# EAGLE design NXPESC-UF1_test004 (EAGLE 7.6.0)

## Sheet 1 of 4
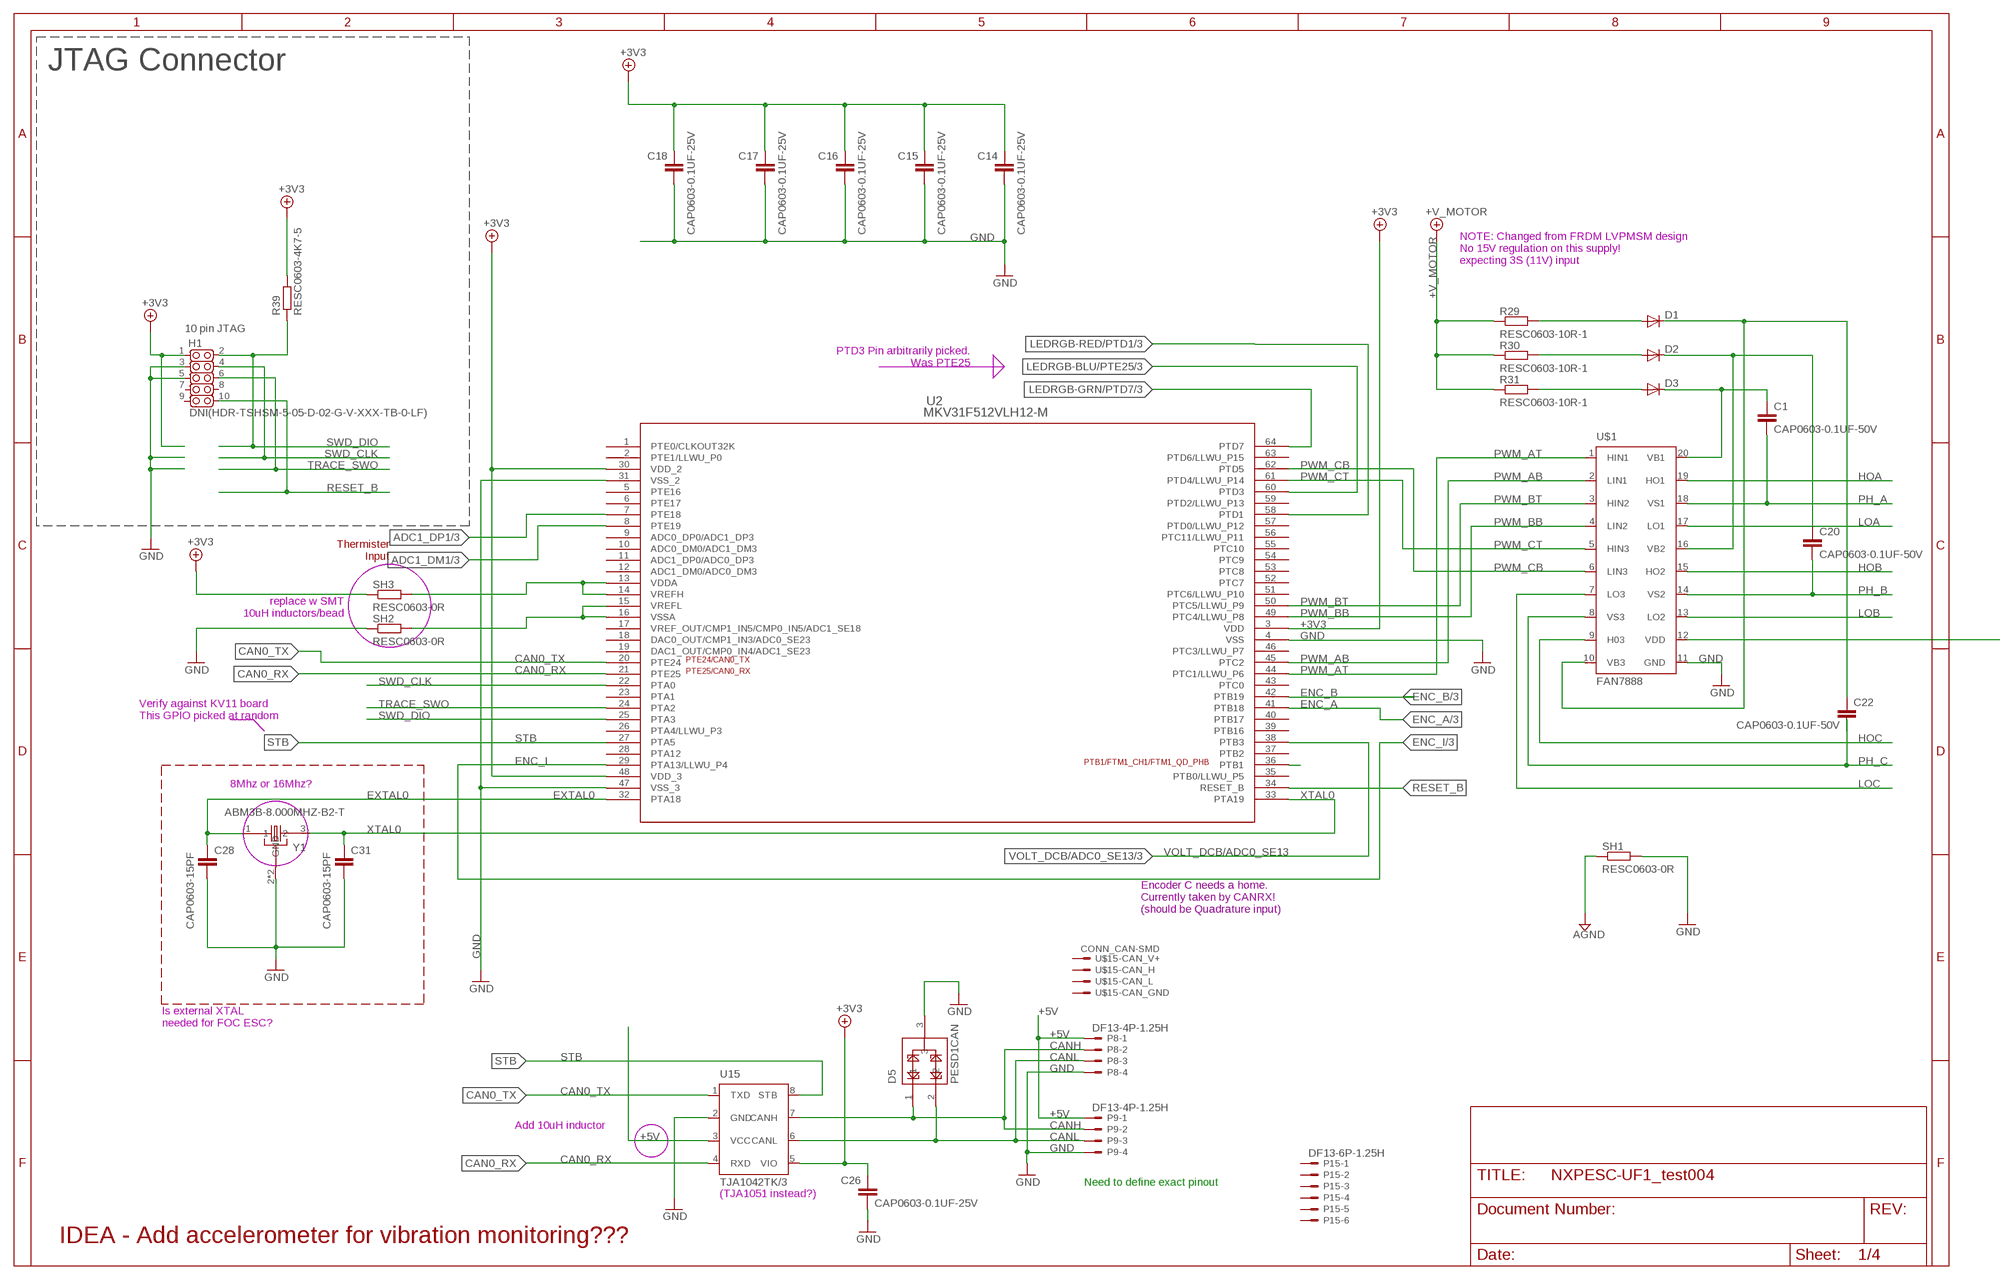
[diagram p0: schematic, sheet 1, part 1 of 2]
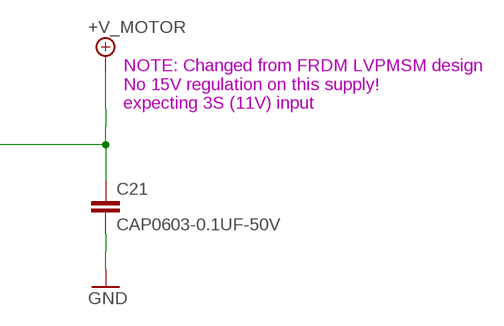
[diagram p1: schematic, sheet 1, part 2 of 2]

### Parts
C1  CAP0603-0.1UF-50V  [C0603]
C14  CAP0603-0.1UF-25V  [C0603]
C15  CAP0603-0.1UF-25V  [C0603]
C16  CAP0603-0.1UF-25V  [C0603]
C17  CAP0603-0.1UF-25V  [C0603]
C18  CAP0603-0.1UF-25V  [C0603]
C20  CAP0603-0.1UF-50V  [C0603]
C21  CAP0603-0.1UF-50V  [C0603]
C22  CAP0603-0.1UF-50V  [C0603]
C26  CAP0603-0.1UF-25V  [C0603]
C28  CAP0603-15PF  [C0603]
C31  CAP0603-15PF  [C0603]
D1  DIODE-SOD323-R  [SOD323-R]
D2  DIODE-SOD323-R  [SOD323-R]
D3  DIODE-SOD323-R  [SOD323-R]
D5  PESD1CAN  [SOT23-3]
H1  DNI(HDR-TSHSM-5-05-D-02-G-V-XXX-TB-0-LF)  HDR-TSHSM-5-05-D-02-G-V-XXX-TB-0-LF  [HD2X5-SMD-0.05"]
P8  DF13-4P-1.25H  [DF13A-4P-1.25H]
P9  DF13-4P-1.25H  [DF13A-4P-1.25H]
P15  DF13-6P-1.25H  [DF13A-6P-1.25H]
R29  RESC0603-10R-1  [C0603]
R30  RESC0603-10R-1  [C0603]
R31  RESC0603-10R-1  [C0603]
R39  RESC0603-4K7-5  [C0603]
SH1  RESC0603-0R  [C0603]
SH2  RESC0603-0R  [C0603]
SH3  RESC0603-0R  [C0603]
U2  MKV31F512VLH12-M  [LQFP-64_10X10X1_6-M]
U15  TJA1042TK/3  [HVSON8]
U$1  FAN7888  [SOIC-20]
U$15  CONN_CAN-SMD  [S4B-PH-SM4-TB]
Y1  ABM3B-8.000MHZ-B2-T  [OSCSC500X320X110-4N]

### Nets
+3V3: C14.1 C15.1 C16.1 C17.1 C18.1 C26.1 H1.1 R39.2 SH3.1 U2.3(VDD) U2.30(VDD_2) U2.48(VDD_3) U15.5(VIO) ; also sheet 2,3
+5V: P8.1 P9.1 U15.3(VCC) ; also sheet 3
+V_MOTOR: C21.1 R29.1 R30.1 R31.1 U$1.12(VDD) ; also sheet 2,3
ADC1_DM1: U2.8(PTE19) ; also sheet 3
ADC1_DP1: U2.7(PTE18) ; also sheet 3
AGND: SH1.1 ; also sheet 2,3
CAN0_RX: U2.21(PTE25) U15.4(RXD)
CAN0_TX: U2.20(PTE24) U15.1(TXD)
CANH: D5.1 P8.2 P9.2 U15.7(CANH)
CANL: D5.2 P8.3 P9.3 U15.6(CANL)
ENC_A: U2.41(PTB18) ; also sheet 3
ENC_B: U2.42(PTB19) ; also sheet 3
ENC_I: U2.29(PTA13/LLWU_P4) ; also sheet 3
EXTAL0: C28.1 U2.32(PTA18) Y1.1
GND: C14.2 C15.2 C16.2 C17.2 C18.2 C21.2 C26.2 C28.2 C31.2 D5.3 H1.3 H1.5 P8.4 P9.4 SH1.2 SH2.1 U2.4(VSS) U2.31(VSS_2) U2.47(VSS_3) U15.2(GND) U$1.11(GND) Y1.2(GND) Y1.4(GND) ; also sheet 2,3
HOA: U$1.19(HO1) ; also sheet 2
HOB: U$1.15(HO2) ; also sheet 2
HOC: U$1.9(H03) ; also sheet 2
LEDRGB-BLU/PTE25: U2.60(PTD3) ; also sheet 3
LEDRGB-GRN/PTD7: U2.64(PTD7) ; also sheet 3
LEDRGB-RED/PTD1: U2.58(PTD1) ; also sheet 3
LOA: U$1.17(LO1) ; also sheet 2
LOB: U$1.13(LO2) ; also sheet 2
LOC: U$1.7(LO3) ; also sheet 2
N$5: D1.A R29.2
N$6: D2.A R30.2
N$7: D3.A R31.2
N$8: U2.36(PTB1)
N$15: C1.1 D3.C U$1.20(VB1)
N$16: C20.1 D2.C U$1.16(VB2)
N$18: C22.1 D1.C U$1.10(VB3)
N$31: SH3.2 U2.13(VDDA) U2.14(VREFH)
N$32: SH2.2 U2.15(VREFL) U2.16(VSSA)
PH_A: C1.2 U$1.18(VS1) ; also sheet 2
PH_B: C20.2 U$1.14(VS2) ; also sheet 2
PH_C: C22.2 U$1.8(VS3) ; also sheet 2
PWM_AB: U2.45(PTC2) U$1.2(LIN1)
PWM_AT: U2.44(PTC1/LLWU_P6) U$1.1(HIN1)
PWM_BB: U2.49(PTC4/LLWU_P8) U$1.4(LIN2)
PWM_BT: U2.50(PTC5/LLWU_P9) U$1.3(HIN2)
PWM_CB: U2.62(PTD5) U$1.6(LIN3)
PWM_CT: U2.61(PTD4/LLWU_P14) U$1.5(HIN3)
RESET_B: H1.10 U2.34(RESET_B)
STB: U2.27(PTA5) U15.8(STB)
SWD_CLK: H1.4 U2.22(PTA0)
SWD_DIO: H1.2 R39.1 U2.25(PTA3)
TRACE_SWO: H1.6 U2.24(PTA2)
VOLT_DCB/ADC0_SE13: U2.38(PTB3) ; also sheet 3
XTAL0: C31.1 U2.33(PTA19) Y1.3
Unconnected: H1.7 H1.8 H1.9 P15.1 P15.2 P15.3 P15.4 P15.5 P15.6 U2.1(PTE0/CLKOUT32K) U2.2(PTE1/LLWU_P0) U2.5(PTE16) U2.6(PTE17) U2.9(ADC0_DP0/ADC1_DP3) U2.10(ADC0_DM0/ADC1_DM3) U2.11(ADC1_DP0/ADC0_DP3) U2.12(ADC1_DM0/ADC0_DM3) U2.17(VREF_OUT/CMP1_IN5/CMP0_IN5/ADC1_SE18) U2.18(DAC0_OUT/CMP1_IN3/ADC0_SE23) U2.19(DAC1_OUT/CMP0_IN4/ADC1_SE23) U2.23(PTA1) U2.26(PTA4/LLWU_P3) U2.28(PTA12) U2.35(PTB0/LLWU_P5) U2.37(PTB2) U2.39(PTB16) U2.40(PTB17) U2.43(PTC0) U2.46(PTC3/LLWU_P7) U2.51(PTC6/LLWU_P10) U2.52(PTC7) U2.53(PTC8) U2.54(PTC9) U2.55(PTC10) U2.56(PTC11/LLWU_P11) U2.57(PTD0/LLWU_P12) U2.59(PTD2/LLWU_P13) U2.63(PTD6/LLWU_P15) U$15.1 U$15.2 U$15.3 U$15.4

### Notes on the sheet
- JTAG Connector
- NOTE: Changed from FRDM LVPMSM design
  No 15V regulation on this supply!
  expecting 3S (11V) input
- 10 pin JTAG
- PTD3 Pin arbitrarily picked.
  Was PTE25
- Thermister
  Input
- replace w SMT
  10uH inductors/bead
- NOTE: Changed from FRDM LVPMSM design
  No 15V regulation on this supply!
  expecting 3S (11V) input
- PTE24/CAN0_TX
- PTE25/CAN0_RX
- Verify against KV11 board
  This GPIO picked at random
- PTB1/FTM1_CH1/FTM1_QD_PHB
- 8Mhz or 16Mhz?
- Encoder C needs a home. 
  Currently taken by CANRX!
  (should be Quadrature input)
- Is external XTAL 
  needed for FOC ESC?
- Add 10uH inductor
- Need to define exact pinout
- (TJA1051 instead?)
- IDEA - Add accelerometer for vibration monitoring???

## Sheet 2 of 4
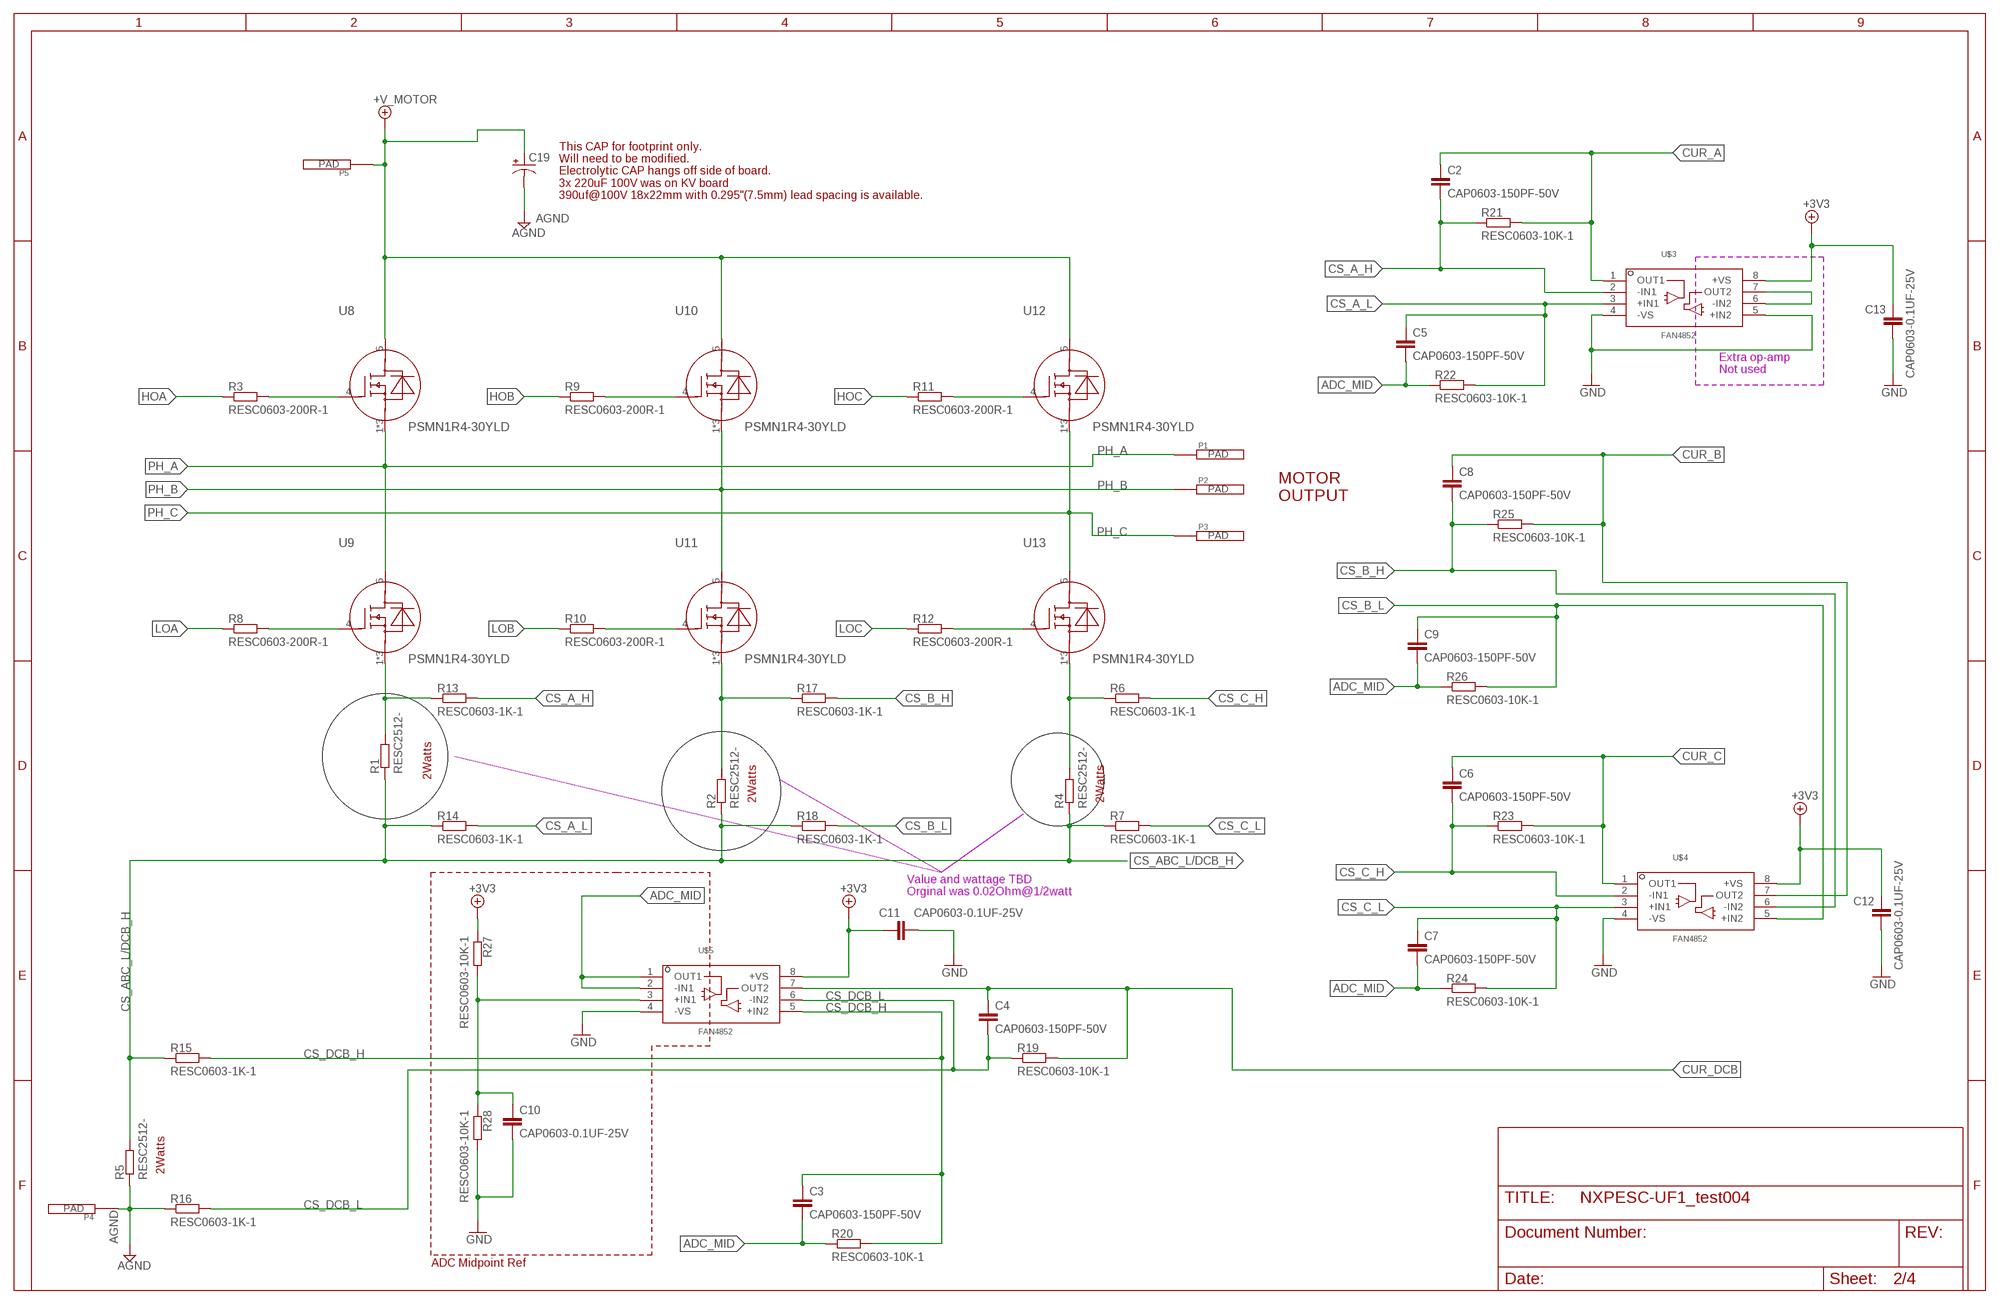
[diagram p2: schematic, sheet 2]

### Parts
C2  CAP0603-150PF-50V  [C0603]
C3  CAP0603-150PF-50V  [C0603]
C4  CAP0603-150PF-50V  [C0603]
C5  CAP0603-150PF-50V  [C0603]
C6  CAP0603-150PF-50V  [C0603]
C7  CAP0603-150PF-50V  [C0603]
C8  CAP0603-150PF-50V  [C0603]
C9  CAP0603-150PF-50V  [C0603]
C10  CAP0603-0.1UF-25V  [C0603]
C11  CAP0603-0.1UF-25V  [C0603]
C12  CAP0603-0.1UF-25V  [C0603]
C13  CAP0603-0.1UF-25V  [C0603]
C19  CPOL-USETR1  [ETR1]
P1  MOT_PWR_PAD-1  [MPAD1]
P2  MOT_PWR_PAD-1  [MPAD1]
P3  MOT_PWR_PAD-1  [MPAD1]
P4  MOT_PWR_PAD-1  [MPAD1]
P5  MOT_PWR_PAD-1  [MPAD1]
R1  RESC2512-  [R2512]
R2  RESC2512-  [R2512]
R3  RESC0603-200R-1  [C0603]
R4  RESC2512-  [R2512]
R5  RESC2512-  [R2512]
R6  RESC0603-1K-1  [C0603]
R7  RESC0603-1K-1  [C0603]
R8  RESC0603-200R-1  [C0603]
R9  RESC0603-200R-1  [C0603]
R10  RESC0603-200R-1  [C0603]
R11  RESC0603-200R-1  [C0603]
R12  RESC0603-200R-1  [C0603]
R13  RESC0603-1K-1  [C0603]
R14  RESC0603-1K-1  [C0603]
R15  RESC0603-1K-1  [C0603]
R16  RESC0603-1K-1  [C0603]
R17  RESC0603-1K-1  [C0603]
R18  RESC0603-1K-1  [C0603]
R19  RESC0603-10K-1  [C0603]
R20  RESC0603-10K-1  [C0603]
R21  RESC0603-10K-1  [C0603]
R22  RESC0603-10K-1  [C0603]
R23  RESC0603-10K-1  [C0603]
R24  RESC0603-10K-1  [C0603]
R25  RESC0603-10K-1  [C0603]
R26  RESC0603-10K-1  [C0603]
R27  RESC0603-10K-1  [C0603]
R28  RESC0603-10K-1  [C0603]
U8  PSMN1R4-30YLD  [LFPAK56]
U9  PSMN1R4-30YLD  [LFPAK56]
U10  PSMN1R4-30YLD  [LFPAK56]
U11  PSMN1R4-30YLD  [LFPAK56]
U12  PSMN1R4-30YLD  [LFPAK56]
U13  PSMN1R4-30YLD  [LFPAK56]
U$3  FAN4852  [SOP65P490X110-8N]
U$4  FAN4852  [SOP65P490X110-8N]
U$5  FAN4852  [SOP65P490X110-8N]

### Nets
+3V3: C11.1 C12.1 C13.1 R27.1 U$3.8(+VS) U$4.8(+VS) U$5.8(+VS) ; also sheet 1,3
+V_MOTOR: C19.+ P5.P$1(PAD) U8.5(D) U10.5(D) U12.5(D) ; also sheet 1,3
ADC_MID: C3.2 C5.2 C7.2 C9.2 R20.1 R22.1 R24.1 R26.1 U$5.1(OUT1) U$5.2(-IN1)
AGND: C19.- P4.P$1(PAD) R5.1 R16.1 ; also sheet 1,3
CS_A_H: C2.2 R13.2 R21.1 U$3.2(-IN1)
CS_A_L: C5.1 R14.2 R22.2 U$3.3(+IN1)
CS_ABC_L/DCB_H: R1.1 R2.1 R4.1 R5.2 R7.1 R14.1 R15.1 R18.1
CS_B_H: C8.2 R17.2 R25.1 U$4.6(-IN2)
CS_B_L: C9.1 R18.2 R26.2 U$4.5(+IN2)
CS_C_H: C6.2 R6.2 R23.1 U$4.2(-IN1)
CS_C_L: C7.1 R7.2 R24.2 U$4.3(+IN1)
CS_DCB_H: C3.1 R15.2 R20.2 U$5.5(+IN2)
CS_DCB_L: C4.2 R16.2 R19.1 U$5.6(-IN2)
CUR_A: C2.1 R21.2 U$3.1(OUT1)
CUR_B: C8.1 R25.2 U$4.7(OUT2)
CUR_C: C6.1 R23.2 U$4.1(OUT1)
CUR_DCB: C4.1 R19.2 U$5.7(OUT2)
GND: C10.2 C11.2 C12.2 C13.2 R28.2 U$3.4(-VS) U$3.5(+IN2) U$4.4(-VS) U$5.4(-VS) ; also sheet 1,3
HOA: R3.1 ; also sheet 1
HOB: R9.1 ; also sheet 1
HOC: R11.1 ; also sheet 1
LOA: R8.1 ; also sheet 1
LOB: R10.1 ; also sheet 1
LOC: R12.1 ; also sheet 1
N$1: R3.2 U8.4(G)
N$2: R1.2 R13.1 U9.1(S) U9.2(S) U9.3(S)
N$3: R8.2 U9.4(G)
N$4: R9.2 U10.4(G)
N$9: R10.2 U11.4(G)
N$10: R11.2 U12.4(G)
N$11: R2.2 R17.1 U11.1(S) U11.2(S) U11.3(S)
N$12: R4.2 R6.1 U13.1(S) U13.2(S) U13.3(S)
N$13: U$3.6(-IN2) U$3.7(OUT2)
N$14: C10.1 R27.2 R28.1 U$5.3(+IN1)
N$17: R12.2 U13.4(G)
PH_A: P1.P$1(PAD) U8.1(S) U8.2(S) U8.3(S) U9.5(D) ; also sheet 1
PH_B: P2.P$1(PAD) U10.1(S) U10.2(S) U10.3(S) U11.5(D) ; also sheet 1
PH_C: P3.P$1(PAD) U12.1(S) U12.2(S) U12.3(S) U13.5(D) ; also sheet 1

### Notes on the sheet
- This CAP for footprint only.
  Will need to be modified.
  Electrolytic CAP hangs off side of board.
  3x 220uF 100V was on KV board
  390uf@100V 18x22mm with 0.295"(7.5mm) lead spacing is available.
- Extra op-amp
  Not used
- MOTOR
  OUTPUT
- 2Watts
- 2Watts | 2Watts
- Value and wattage TBD
  Orginal was 0.02Ohm@1/2watt
- 2Watts
- ADC Midpoint Ref

## Sheet 3 of 4
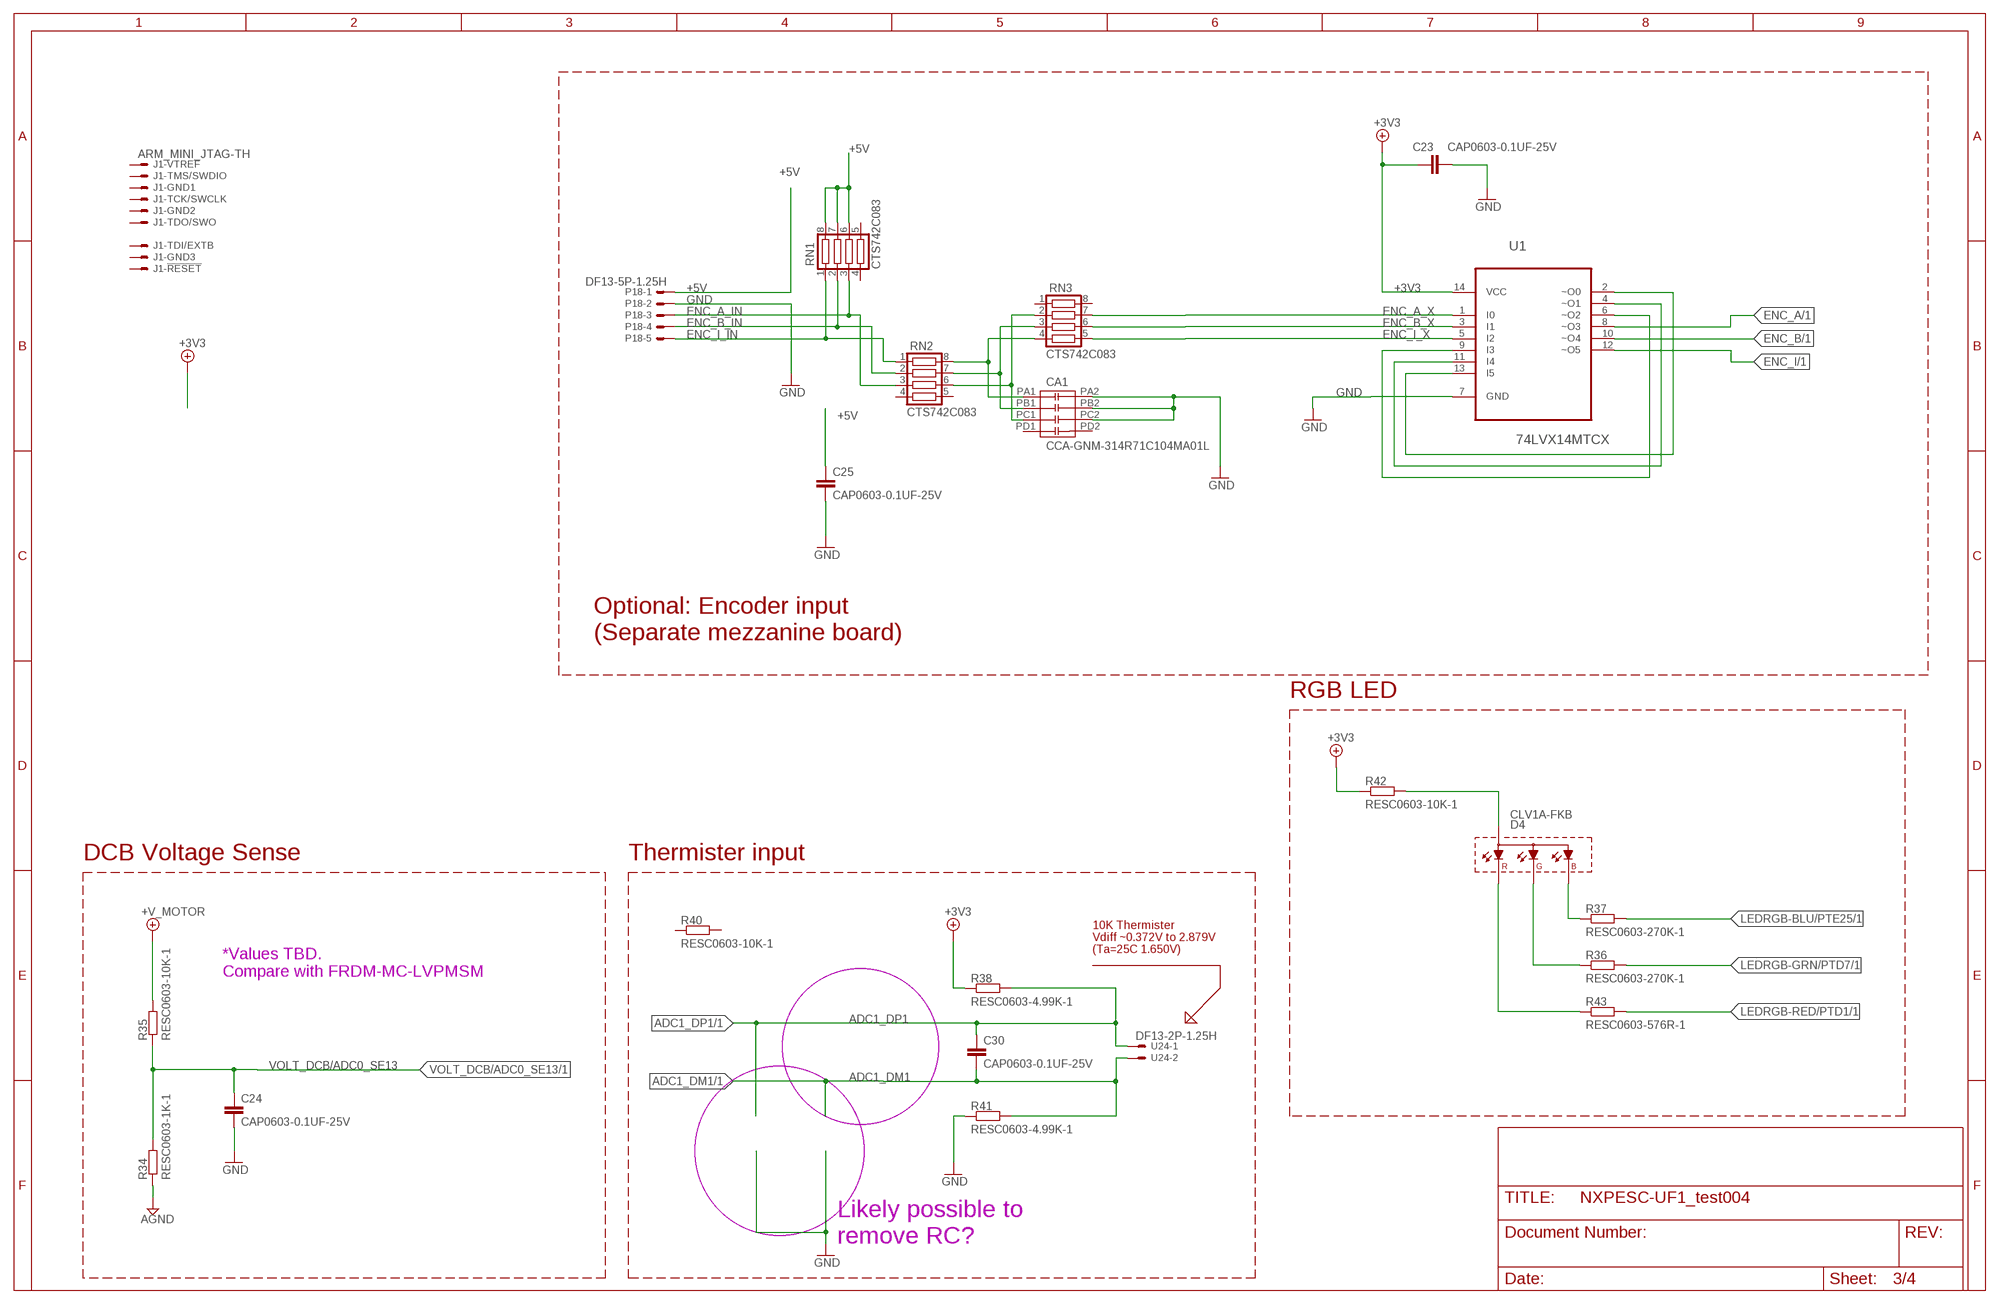
[diagram p3: schematic, sheet 3]

### Parts
C23  CAP0603-0.1UF-25V  [C0603]
C24  CAP0603-0.1UF-25V  [C0603]
C25  CAP0603-0.1UF-25V  [C0603]
C30  CAP0603-0.1UF-25V  [C0603]
CA1  CCA-GNM-314R71C104MA01L  [RES_ARRAY_4I_S]
D4  CLV1A-FKB  [4-PLCC]
J1  ARM_MINI_JTAG-TH  [FTSH-105-01-XXX-DV]
P18  DF13-5P-1.25H  [DF13A-5P-1.25H]
R34  RESC0603-1K-1  [C0603]
R35  RESC0603-10K-1  [C0603]
R36  RESC0603-270K-1  [C0603]
R37  RESC0603-270K-1  [C0603]
R38  RESC0603-4.99K-1  [C0603]
R40  RESC0603-10K-1  [C0603]
R41  RESC0603-4.99K-1  [C0603]
R42  RESC0603-10K-1  [C0603]
R43  RESC0603-576R-1  [C0603]
RN1  CTS742C083  [CTS742C083]
RN2  CTS742C083  [CTS742C083]
RN3  CTS742C083  [CTS742C083]
U1  74LVX14MTCX  [SOP65P640X120-14N]
U24  DF13-2P-1.25H  [DF13A-2P-1.25H]

### Nets
+3V3: C23.1 R38.1 R42.1 U1.14(VCC) ; also sheet 1,2
+5V: C25.1 P18.1 RN1.6 RN1.7 RN1.8 ; also sheet 1
+V_MOTOR: R35.2 ; also sheet 1,2
ADC1_DM1: C30.2 R41.2 U24.2 ; also sheet 1
ADC1_DP1: C30.1 R38.2 U24.1 ; also sheet 1
AGND: R34.1 ; also sheet 1,2
ENC_A: U1.8(~O3) ; also sheet 1
ENC_A_IN: P18.3 RN1.3 RN2.3
ENC_A_X: RN3.7 U1.1(I0)
ENC_B: U1.10(~O4) ; also sheet 1
ENC_B_IN: P18.4 RN1.2 RN2.2
ENC_B_X: RN3.6 U1.3(I1)
ENC_I: U1.12(~O5) ; also sheet 1
ENC_I_IN: P18.5 RN1.1 RN2.1
ENC_I_X: RN3.5 U1.5(I2)
GND: C23.2 C24.2 C25.2 CA1.PA2(RA2) CA1.PB2(RB2) CA1.PC2(RC2) P18.2 R41.1 U1.7(GND) ; also sheet 1,2
LEDRGB-BLU/PTE25: R37.2 ; also sheet 1
LEDRGB-GRN/PTD7: R36.2 ; also sheet 1
LEDRGB-RED/PTD1: R43.2 ; also sheet 1
N$19: U1.2(~O0) U1.13(I5)
N$20: CA1.PA1(RA1) RN2.8 RN3.4
N$21: CA1.PB1(RB1) RN2.7 RN3.3
N$22: CA1.PC1(RC1) RN2.6 RN3.2
N$23: U1.4(~O1) U1.11(I4)
N$24: U1.6(~O2) U1.9(I3)
N$25: D4.2(A) R42.2
N$28: D4.3(CBLUE) R37.1
N$29: D4.4(CGREEN) R36.1
N$30: D4.1(CRED) R43.1
VOLT_DCB/ADC0_SE13: C24.1 R34.2 R35.1 ; also sheet 1
Unconnected: CA1.PD1(RD1) CA1.PD2(RD2) J1.1 J1.2 J1.3 J1.4 J1.5 J1.6 J1.8 J1.9 J1.10 R40.1 R40.2 RN1.4 RN1.5 RN2.4 RN2.5 RN3.1 RN3.8

### Notes on the sheet
- Optional: Encoder input
  (Separate mezzanine board)
- RGB LED
- DCB Voltage Sense | Thermister input
- 10K Thermister
  Vdiff ~0.372V to 2.879V
  (Ta=25C 1.650V)
- *Values TBD.
  Compare with FRDM-MC-LVPMSM
- Likely possible to 
  remove RC?

## Sheet 4 of 4

## Library data of the parts
C1-C18 C20-C26 C28 C30 C31 = etc-rcl:CAP?-*: Capacitors with ETC part numbers. package 1812 are actually 1808 Y capacitors
C19 = etc-rcl:CPOL-US: POLARIZED CAPACITOR, American symbol
CA1 = etc-rcl:CCA-?-*: CAP 4-ARRAY .1UF 16V X7R 1206
D1-D3 = etc-diode_002a:DIODE-: DIODE
D4 = CLV1A-FKB:CLV1A-FKB: 3- COLOR LED
D5 = PESD1CAN:PESD1CAN: PESD1CAN is used to protect two automotive CAN bus lines from ESD.
H1 = etc-connector-002a:HDR-TSHSM-5-*-D-02-G-V-XXX-TB-0-LF: Product Number: TSHSM-5-DV Terminal strip header Pitch: .050" x .050" Pin length: .065-.393 Pins per row: 01-40 Surface mount Dual row Straight Termination Type: PCB
J1 = pixhawk2:ARM_MINI_JTAG: CONNECTOR wire to board 1.25 mm (.049 inch) pitch header
P1-P5 = NXPHLITE:MOT_PWR_PAD: SMD PAD for BLDC motor wiring to solder to.
P8 P9 = pixhawk2:DF13-4P-1.25?
P15 = pixhawk2:DF13-6P-1.25?
P18 = pixhawk2:DF13-5P-1.25?
R1-R31 R34-R38 R40-R43 SH1-SH3 = etc-rcl:RESC?-*: Resistors with ETC part numbers.
R39 = etc_rcl:RESC?-*: Resistors with ETC part numbers.
RN1-RN3 = pixhawk2:CTS742C083: Chip Resistor Array 4 Single Resistor Source: http://www.ctscorp.com/components/Datasheets/CTSChipArrayDs.pdf; OC_FARNELL: unknown; OC_NEWARK: unknown
U1 = 74LVX14MTCX:74LVX14MTCX: Low Voltage Hex Inverter with Schmitt Trigger Input
U2 = MKV31F512VLH12:MKV31F512VLH12
U8-U13 = PSMN1R2-25YL_115:PSMN1R4-30YLD: NXP PSMN1R4
U15 = TJA1042T:TJA1042T
U24 = pixhawk2:DF13-2P-1.25?
U$1 = FAN7888:FAN7888
U$3-U$5 = NXPHLITE:FAN4852: FAN4852 9MHz Low-Power Dual CMOS Amplifier The FAN4852 is a dual, rail-to-rail output, low-power, CMOS amplifier that consumes only 800µA of supply current, while providing ±50mA of output short-circuit current. This amplifier is designed to operate supplies from 2.5V to 5V. Additionally, the FAN4852 is EMI hardened, which minimizes EMI interference. It has a maximum input offset voltage of 1mV and an input common-mode range that includes ground. The FAN4852 is designed on a CMOS process and provides 9MHz of bandwidth and 6V/µs of slew rate. The combination of low-power, low-voltage operation and a small package make this amplifier well suited for general-purpose and battery-powered applications.
U$15 = pixhawk2:CONN_CAN
Y1 = ABM3B-8.000MHZ-B2-T:ABM3B-8.000MHZ-B2-T: Crystal 8MHz ±20ppm (Tol) ±50ppm (Stability) 18pF FUND 200Ohm 4-Pin CSMD T/R

## Board
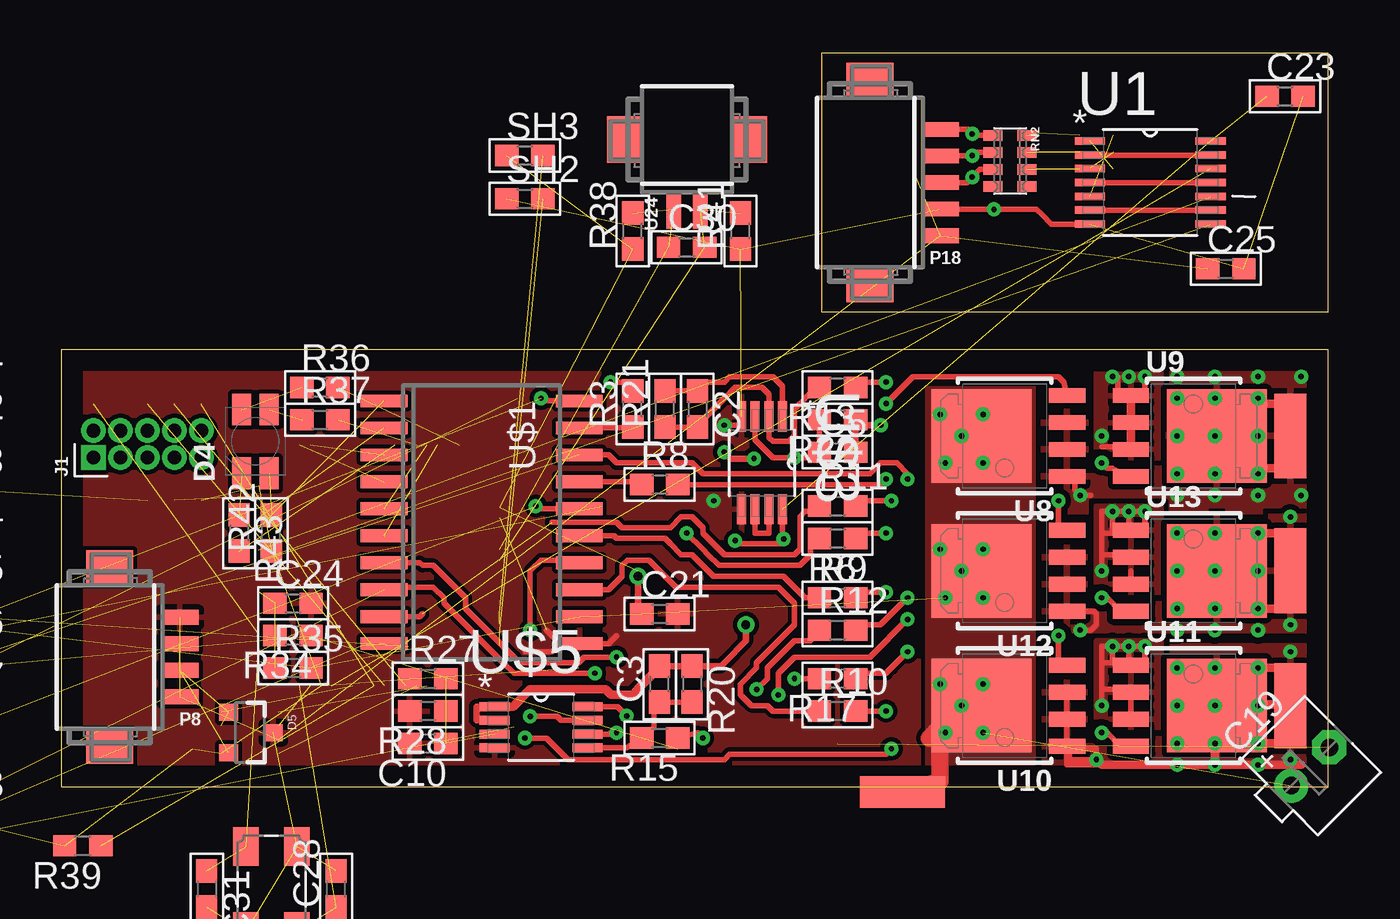
[diagram p4: board, top side]
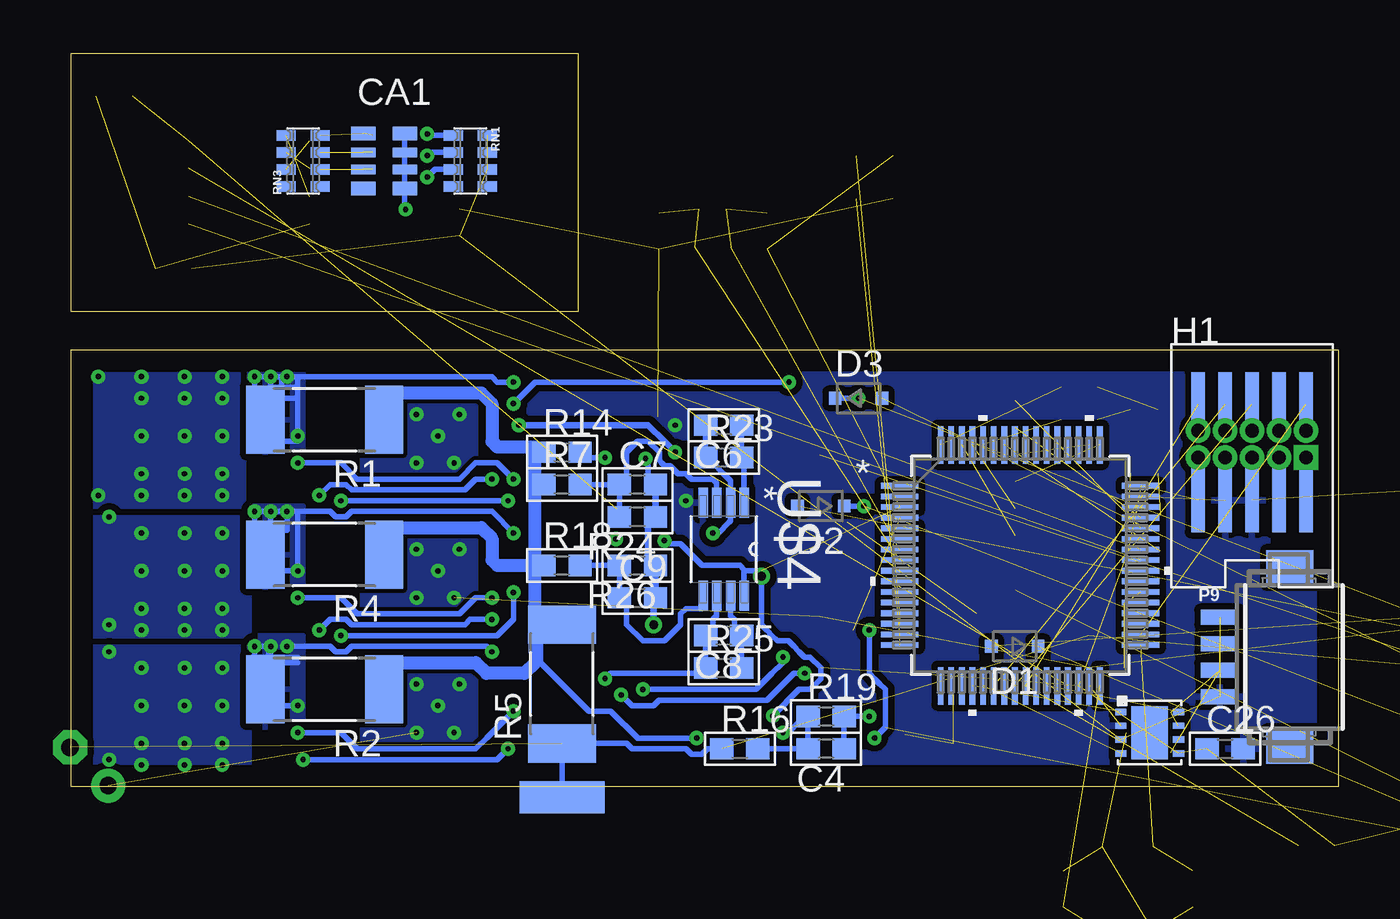
[diagram p5: board, bottom side, seen from below]

Size 59.69 x 34.54 mm. Coordinates in mm from the lower left corner, seen from the top.
Outline: 0,0 59.69,0 59.69,20.57 0,20.57 0,0
Outline: 35.81,22.35 59.69,22.35 59.69,34.54 35.81,34.54 35.81,22.35
Copper layers (1*16): Top 0.035mm / dielectric 1.5mm / Bottom 0.035mm
Design rules "default *": minimum track width 10mil, minimum drill 10mil, track to track 8mil, track to pad 8mil, pad to pad 8mil, via to via 8mil, smd to smd 8mil, copper to edge 40mil, drill to drill 8mil, minimum pad ring 10mil, minimum via ring 8mil, stop-mask expansion 4mil, vias tented up to drill 0mil, thermal gap 10mil

### Footprints (pad centres in the part's own frame; a part is rotated, then mirrored left to right if it is on the bottom)
C0603 = smd 1.1 x 1: 1 -0.85,0; 2 0.85,0
ETR1 = drill 0.813 pad 1.6: + -1.27,0 | drill 0.813 pad 1.6 octagon: - 1.27,0
RES_ARRAY_4I_S = smd 1.15 x 0.63: PA1 -0.975,1.3; PA2 0.975,1.3; PD1 -0.975,-1.3; PD2 0.975,-1.3 | smd 1.15 x 0.44: PB1 -0.975,0.4; PB2 0.975,0.4; PC1 -0.975,-0.4; PC2 0.975,-0.4
SOD323-R = smd 0.6 x 0.6: A 1.1,0; C -1.1,0
4-PLCC = smd 1.5 x 0.9: 1 -1.5,0.65; 2 -1.5,-0.65; 3 1.5,-0.65; 4 1.5,0.65
SOT23-3 = smd 0.8 x 0.9: 1 -0.95,-1; 2 0.95,-1; 3 0,1.1
HD2X5-SMD-0.05" = smd 0.648 x 3.023: 1 -2.54,-2.254; 2 -2.54,2.254; 3 -1.27,-2.254; 4 -1.27,2.254; 5 0,-2.254; 6 0,2.254; 7 1.27,-2.254; 8 1.27,2.254; 9 2.54,-2.254; 10 2.54,2.254
FTSH-105-01-XXX-DV = drill 0.65 pad 1.06 square: 1 0,0 | drill 0.65 pad 1.06: 2 0,1.27; 3 1.27,0; 4 1.27,1.27; 5 2.54,0; 6 2.54,1.27; 7 3.81,0; 8 3.81,1.27; 9 5.08,0; 10 5.08,1.27
MPAD1 = smd 4 x 1.5: P$1 0,0
DF13A-4P-1.25H = smd 0.7 x 1.8: 1 -1.875,-3.3; 2 -0.625,-3.3; 3 0.625,-3.3; 4 1.875,-3.3 | smd 1.6 x 2.2: S1 4.225,0; S2 -4.225,0
DF13A-6P-1.25H = smd 0.7 x 1.8: 1 -3.125,-3.3; 2 -1.875,-3.3; 3 -0.625,-3.3; 4 0.625,-3.3; 5 1.875,-3.3; 6 3.125,-3.3 | smd 1.6 x 2.2: S1 5.475,0; S2 -5.475,0
DF13A-5P-1.25H = smd 0.7 x 1.8: 1 -2.5,-3.3; 2 -1.25,-3.3; 3 0,-3.3; 4 1.25,-3.3; 5 2.5,-3.3 | smd 1.6 x 2.2: S1 4.85,0; S2 -4.85,0
R2512 = smd 1.8 x 3.2: 1 -2.8,0; 2 2.8,0
CTS742C083 = smd 0.5 x 0.9: 1 -1.2,-0.8; 2 -0.4,-0.8; 3 0.4,-0.8; 4 1.2,-0.8; 5 1.2,0.8; 6 0.4,0.8; 7 -0.4,0.8; 8 -1.2,0.8
SOP65P640X120-14N = smd 1.422 x 0.356: 1 -2.845,1.956; 2 -2.845,1.295; 3 -2.845,0.66; 4 -2.845,0; 5 -2.845,-0.66; 6 -2.845,-1.295; 7 -2.845,-1.956; 8 2.845,-1.956; 9 2.845,-1.295; 10 2.845,-0.66; 11 2.845,0; 12 2.845,0.66; 13 2.845,1.295; 14 2.845,1.956
LQFP-64_10X10X1_6-M = smd 1.766 x 0.27: 1 -5.676,3.75; 2 -5.676,3.25; 3 -5.676,2.75; 4 -5.676,2.25; 5 -5.676,1.75; 6 -5.676,1.25; 7 -5.676,0.75; 8 -5.676,0.25; 9 -5.676,-0.25; 10 -5.676,-0.75; 11 -5.676,-1.25; 12 -5.676,-1.75; 13 -5.676,-2.25; 14 -5.676,-2.75; 15 -5.676,-3.25; 16 -5.676,-3.75; 33 5.676,-3.75; 34 5.676,-3.25; 35 5.676,-2.75; 36 5.676,-2.25; 37 5.676,-1.75; 38 5.676,-1.25; 39 5.676,-0.75; 40 5.676,-0.25; 41 5.676,0.25; 42 5.676,0.75; 43 5.676,1.25; 44 5.676,1.75; 45 5.676,2.25; 46 5.676,2.75; 47 5.676,3.25; 48 5.676,3.75 | smd 0.27 x 1.766: 17 -3.75,-5.676; 18 -3.25,-5.676; 19 -2.75,-5.676; 20 -2.25,-5.676; 21 -1.75,-5.676; 22 -1.25,-5.676; 23 -0.75,-5.676; 24 -0.25,-5.676; 25 0.25,-5.676; 26 0.75,-5.676; 27 1.25,-5.676; 28 1.75,-5.676; 29 2.25,-5.676; 30 2.75,-5.676; 31 3.25,-5.676; 32 3.75,-5.676; 49 3.75,5.676; 50 3.25,5.676; 51 2.75,5.676; 52 2.25,5.676; 53 1.75,5.676; 54 1.25,5.676; 55 0.75,5.676; 56 0.25,5.676; 57 -0.25,5.676; 58 -0.75,5.676; 59 -1.25,5.676; 60 -1.75,5.676; 61 -2.25,5.676; 62 -2.75,5.676; 63 -3.25,5.676; 64 -3.75,5.676
LFPAK56 = smd 0.7 x 1.7: 1 -1.905,-2.94; 2 -0.635,-2.94; 3 0.635,-2.94; 4 1.905,-2.94 | smd 4.4 x 4.7: 5 0,1.1
HVSON8 = smd 0.3 x 0.525: 1 -0.975,-1.363; 2 -0.325,-1.363; 3 0.325,-1.363; 4 0.975,-1.363; 5 0.975,1.363; 6 0.325,1.363; 7 -0.325,1.363; 8 -0.975,1.363 | smd 2.5 x 1.7: P$1 0,0
DF13A-2P-1.25H = smd 0.7 x 1.8: 1 -0.605,-3.3; 2 0.645,-3.3 | smd 1.6 x 2.2: S1 2.995,0; S2 -2.955,0
SOIC-20 = smd 0.6 x 2.2: 1 -5.715,-4.6; 2 -4.445,-4.6; 3 -3.175,-4.6; 4 -1.905,-4.6; 5 -0.635,-4.6; 6 0.635,-4.6; 7 1.905,-4.6; 8 3.175,-4.6; 9 4.445,-4.6; 10 5.715,-4.6; 11 5.715,4.6; 12 4.445,4.6; 13 3.175,4.6; 14 1.905,4.6; 15 0.635,4.6; 16 -0.635,4.6; 17 -1.905,4.6; 18 -3.175,4.6; 19 -4.445,4.6; 20 -5.715,4.6
SOP65P490X110-8N = smd 1.422 x 0.432: 1 -2.184,0.965; 2 -2.184,0.33; 3 -2.184,-0.33; 4 -2.184,-0.965; 5 2.184,-0.965; 6 2.184,-0.33; 7 2.184,0.33; 8 2.184,0.965
S4B-PH-SM4-TB = smd 1 x 3.5: 1 6,0; 2 4,0; 3 2,0; 4 0,0 | smd 1.5 x 3.4: MOUNT1 -2.35,5.55; MOUNT2 8.35,5.55
OSCSC500X320X110-4N = smd 1.2 x 1.8: 1 -1.2,2; 2 -1.2,-2; 3 1.2,-2; 4 1.2,2

### Placement (x,y rotation side)
C1  -28.45,-1.78 0 top  (outside the outline)
C2  29.97,17.78 270 top
C3  28.19,4.83 90 top
C4  24.13,1.78 180 bottom
C5  36.58,15.75 0 top
C6  28.96,17.02 180 bottom
C7  33.02,14.22 0 bottom
C8  28.96,7.11 180 bottom
C9  33.02,8.89 0 bottom
C10  17.27,2.03 180 top
C11  -5.08,19.05 0 top  (outside the outline)
C12  -5.08,16.51 0 top  (outside the outline)
C13  -5.08,13.97 0 top  (outside the outline)
C14  -5.08,11.43 0 top  (outside the outline)
C15  -5.08,8.89 0 top  (outside the outline)
C16  -5.08,6.35 0 top  (outside the outline)
C17  -5.08,3.81 0 top  (outside the outline)
C18  -5.08,-1.27 0 top  (outside the outline)
C19  58.85,0.94 45 top
C20  -28.45,-6.86 0 top  (outside the outline)
C21  28.19,8.13 0 top
C22  -28.45,-11.94 0 top  (outside the outline)
C23  57.66,32.51 0 top
C24  10.92,8.64 0 top
C25  54.86,24.38 0 top
C26  5.33,1.78 0 bottom
C28  12.95,-4.83 90 top  (outside the outline)
C30  29.46,25.4 0 top
C31  6.86,-4.83 270 top  (outside the outline)
CA1  44.96,29.46 0 bottom
D1  15.24,6.6 180 bottom
D2  24.38,13.21 180 bottom
D3  22.61,18.29 0 bottom
D4  9.14,16.26 90 top
D5  8.89,2.54 270 top
H1  4.06,15.75 0 bottom
J1  1.52,15.49 0 top
P1  57.91,16.51 90 top
P2  57.91,3.81 90 top
P3  57.91,10.16 270 top
P4  36.58,-0.51 180 bottom
P5  39.62,-0.25 0 top
P8  2.29,6.1 90 top
P9  2.29,6.1 270 bottom
P15  -22.61,22.35 0 top  (outside the outline)
P18  38.1,28.45 90 top
R1  47.75,17.27 180 bottom
R2  47.75,4.57 180 bottom
R3  26.92,17.78 90 top
R4  47.75,10.92 180 bottom
R5  36.58,4.83 90 bottom
R6  36.58,11.68 180 top
R7  36.58,14.22 0 bottom
R8  28.19,14.22 0 top
R9  36.58,8.89 0 top
R10  36.58,3.56 0 top
R11  36.58,13.21 0 top
R12  36.58,7.37 0 top
R13  36.58,18.8 180 top
R14  36.58,15.75 0 bottom
R15  28.19,2.29 180 top
R16  28.19,1.78 0 bottom
R17  36.58,5.08 180 top
R18  36.58,10.41 0 bottom
R19  24.13,3.3 0 bottom
R20  29.72,4.83 270 top
R21  28.45,17.78 90 top
R22  36.58,17.27 180 top
R23  28.96,15.49 0 bottom
R24  33.02,12.7 180 bottom
R25  28.96,5.59 0 bottom
R26  33.02,10.41 180 bottom
R27  17.27,5.08 0 top
R28  17.27,3.56 180 top
R29  -10.67,8.38 0 top  (outside the outline)
R30  -11.18,6.1 0 top  (outside the outline)
R31  -10.92,2.79 0 top  (outside the outline)
R34  10.92,7.11 180 top
R35  10.92,5.59 0 top
R36  12.19,18.8 0 top
R37  12.19,17.27 0 top
R38  26.92,26.16 90 top
R39  1.02,-2.79 180 top
R40  -38.1,-101.09 0 top  (outside the outline)
R41  32,26.16 90 top
R42  9.91,11.94 90 top
R43  8.38,11.94 270 top
RN1  40.89,29.46 270 bottom
RN2  44.7,29.46 270 top
RN3  48.77,29.46 90 bottom
SH1  -28.13,3.39 0 top  (outside the outline)
SH2  21.84,27.69 0 top
SH3  21.84,29.72 0 top
U1  51.31,28.45 0 top
U2  14.99,10.41 0 bottom
U8  44.45,16.51 90 top
U9  53.34,16.51 270 top
U10  44.45,3.81 90 top
U11  53.34,3.81 270 top
U12  44.45,10.16 90 top
U13  53.34,10.16 270 top
U15  8.89,2.54 270 bottom
U24  29.46,30.48 0 top
U$1  19.81,12.45 270 top
U$3  33.02,15.24 270 top
U$4  28.96,11.18 270 bottom
U$5  22.61,2.79 0 top
U$15  -32,19.05 90 top  (outside the outline)
Y1  9.91,-4.83 180 top

### Tracks (layer width: path | path; a pad name or v marks a point on that pad's centre or on a via)
+3V3  (via drill 0.25, 0.41)  (21 unrouted)
  Top 0.254: U$3.8 33.98,11.73 v34.04,11.66 34.04,11.43 32.26,11.43 31.75,11.43 v31.75,11.58 | U$5.8 26.21,3.76 v26.64,3.33
  Top 0.305: 27.43,8 27.43,8.13 27.18,8.38 v27.18,9.91
  Bottom 0.254: U$4.8 27.99,9.6 27.99,10.21 | 27.99,10.21 28.19,10.41 28.45,10.41 29.97,10.41 30.99,11.43 31.24,11.43 31.62,11.43 v31.75,11.58 | 27.99,10.21 27.94,10.16 27.18,10.16 v27.18,9.91 27.18,7.62 26.92,7.37 26.67,7.11 26.42,6.86 25.91,6.86 25.65,6.6 25.4,6.35 25.15,6.1 24.89,6.1 24.38,5.59 24.38,5.08 24.89,4.57 25.4,4.57 v26.64,3.33
+5V  (7 unrouted)
+V_MOTOR  (via drill 0.25)  (7 unrouted)
  Top 0.813: P5.P$1 41.4,0.25 | 41.4,0.25 41.4,4.32 41.4,0.25 | 41.4,0.25 41.4,2.29 40.89,2.29 41.4,2.79 v41.66,2.54
  other vias: 41.4,17.53 41.66,15.24 43.43,15.24 43.43,2.54 41.4,4.83 41.4,11.18 41.66,8.89 43.43,8.89 43.43,17.53 42.42,16.51 43.43,11.18 42.42,10.16 43.43,4.83 42.42,3.81
  pour Top (isolate 0.305, no thermals): 40.89,20.07 45.72,20.07 45.72,0 40.89,0
  pour Bottom: 40.64,20.57 40.64,0 45.97,0 45.97,20.57
ADC1_DM1  (3 unrouted)
ADC1_DP1  (3 unrouted)
ADC_MID  (via drill 0.25, 0.41)
  Top 0.254: C5.2 R22.1
  Top 0.305: C5.2 37.43,17.02 v38.61,17.02 | C3.2 R20.1 31.08,5.68 31.24,5.84 32.26,6.86 v32.26,7.62 | v32.64,15.44 31.55,15.44 31.5,15.49 31.19,15.8 v31.24,15.75 | U$5.2 19.56,3.12 19.56,3.56 19.56,3.76 U$5.1
  Top 0.406: C3.2 28.17,5.59 27.15,4.57 26.92,4.32 25.91,4.32 25.65,4.57 23.62,4.57 22.1,4.57 21.29,3.76 | U$5.1 21.08,3.76 | 21.08,3.76 21.29,3.76 | 21.29,3.76 21.08,3.76 | 21.08,3.76 21.29,3.76
  Bottom 0.254: 37.85,17.02 37.34,17.02 | 32.51,14.48 C7.2 32.51,14.57 32.51,15.37 32.59,15.44 v32.64,15.44 | 32.26,8.8 C9.2
  Bottom 0.305: v38.61,17.02 37.85,17.02 33.78,17.02 32.51,17.02 31.75,16.26 31.5,16 v31.24,15.75 | C7.2 32.17,13.72 R24.1 | 32.51,12.45 32.51,10.92 32.17,10.58 | R26.1 C9.2 | 32.26,8.8 v32.26,7.62
  Bottom 0.406: R24.1 32.26,12.7 32.51,12.45 | 32.17,10.58 R26.1
AGND  (3 unrouted)
  Bottom 0.254: P4.P$1 R5.1 33.53,2.03 33.27,1.78 30.73,1.78 30.48,1.52 29.97,1.52 29.72,1.78 R16.1
CAN0_RX  (1 unrouted)
CAN0_TX  (1 unrouted)
CANH  (3 unrouted)
CANL  (3 unrouted)
CS_A_H
  Top 0.254: 35.73,18.88 R13.2 35.56,18.8 35.31,18.54 34.8,18.03 34.54,17.78 34.54,16.51 34.29,16.26 33.53,16.26 33.35,16.43 U$3.2 33.35,18.47 33.02,18.8 31.75,18.8 31.24,18.29 30.99,18.03 30.73,17.78 30.23,17.27 30.23,16.93 C2.2 R21.1
CS_A_L  (via drill 0.25)
  Top 0.254: R22.2 R14.2 35.56,15.49 v34.54,15.49 33.53,15.49 32.69,16.33 U$3.3
  Bottom 0.254: v34.54,15.49 35.56,15.49 R14.2
CS_ABC_L/DCB_H  (via drill 0.25)
  Top 0.254: R15.1 29.97,2.54 v30.23,2.29
  Bottom 0.254: v30.23,2.29 33.03,2.29 34.29,3.56 35.31,3.56 37.59,5.84 37.59,6.86 37.85,6.35 | R5.2 37.84,7.63 37.85,7.62 | 37.59,10.33 37.76,10.33 37.85,10.41 | R14.1 37.68,16 37.85,16 37.85,15.84 | R7.1 37.85,14.22
  Bottom 0.406: R1.1 44.96,18.29 44.7,18.54 | R4.1 44.96,10.16 44.96,11.43 44.2,12.19 | R2.1 44.96,3.81 44.7,3.81 44.7,5.84
  Bottom 0.61: 44.7,18.54 40.39,18.54 39.88,18.03 39.88,16.26 39.62,16 37.85,16 | 44.2,12.19 40.39,12.19 39.88,11.68 39.88,10.67 39.62,10.41 37.85,10.41 | 44.7,5.84 40.64,5.84 40.13,5.33 38.35,5.33 37.85,5.84 37.85,6.35 37.85,7.62 37.85,9.99 37.85,10.41 | 37.59,10.33 R18.1 | 37.85,10.41 37.85,14.22 37.85,15.84
CS_B_H  (via drill 0.25)
  Top 0.254: R17.2 34.8,5.08 v34.54,5.08
  Bottom 0.254: U$4.6 29.29,8.05 29.46,7.87 29.46,7.45 C8.2 R25.1 29.81,5.5 29.97,5.33 31.75,5.33 32.26,5.33 34.29,5.33 v34.54,5.08
CS_B_L
  Bottom 0.254: R18.2 R26.2 C9.1 33.78,8.89 33.53,8.64 33.53,7.62 32.77,6.86 31.75,6.86 31.24,7.37 30.99,7.62 30.99,8.13 30.73,8.38 30.23,8.38 29.97,8.38 | 29.97,8.38 29.92,8.43 U$4.5 29.97,9.14 29.97,9.4 29.97,8.38
CS_C_H  (via drill 0.25)
  Top 0.254: R6.2 35.56,11.68 35.31,11.43 35.31,10.92 34.8,10.41 30.99,10.41 30.48,10.92 30.23,11.18 v29.46,11.94
  Bottom 0.254: v29.46,11.94 29.21,11.94 28.7,12.45 28.63,12.52 U$4.2 28.63,14.15 28.63,14.4 28.96,14.73 29.46,15.24 29.72,15.49 R23.1 C6.2
CS_C_L
  Bottom 0.254: U$4.3 29.29,14.3 29.46,14.48 30.48,14.48 30.73,14.73 31.11,14.73 31.5,15.11 31.75,15.11 31.88,15.24 31.98,15.37 31.98,15.75 32.51,16.26 33.02,16.26 33.27,16 33.53,15.75 33.53,14.22 C7.1 | R7.2 C7.1 | C7.1 R24.2
CS_DCB_H
  Top 0.254: U$5.5 26.63,1.83 R15.2 27.43,2.29 27.94,2.79 27.94,3.56 28.19,3.81 C3.1 R20.2
CS_DCB_L  (via drill 0.25)
  Top 0.254: U$5.6 25.83,2.46 25.91,2.54 v26.16,2.54
  Bottom 0.254: R16.2 26.92,1.78 25.4,1.78 C4.2 R19.1 25.15,3.3 25.4,3.05 25.91,2.54 v26.16,2.54
CUR_A
  Top 0.254: R21.2 C2.1 30.48,19.05 31.24,19.05 31.5,19.3 32.77,19.3 33.53,19.3 33.98,18.85 U$3.1
CUR_B
  Bottom 0.254: U$4.7 28.63,8.05 28.45,7.87 28.45,7.45 C8.1 R25.2
CUR_C
  Bottom 0.254: U$4.1 27.99,15.12 R23.2 C6.1
CUR_DCB  (via drill 0.25)
  Top 0.254: U$5.7 23.55,3.12 23.37,3.3 v22.1,3.3
  Bottom 0.254: v22.1,3.3 23.37,3.3 23.37,3.39 R19.2 C4.1
ENC_A  (1 unrouted)
ENC_A_IN  (via drill 0.25)
  Top 0.254: P18.3 42.67,28.45 v42.93,28.7 43.29,29.06 RN2.3
  Bottom 0.254: 42.67,28.96 v42.93,28.7 42.56,29.06 RN1.3
ENC_A_X  (1 unrouted)
ENC_B  (1 unrouted)
ENC_B_IN  (via drill 0.25)
  Top 0.254: P18.4 42.91,29.7 v42.93,29.72 43.07,29.86 RN2.2
  Bottom 0.254: RN1.2 42.78,29.86 v42.93,29.72
ENC_B_X  (1 unrouted)
ENC_I  (1 unrouted)
ENC_I_IN  (via drill 0.25)
  Top 0.254: P18.5 42.71,30.95 v42.93,30.73 43,30.66 RN2.1
  Bottom 0.254: RN1.1 42.86,30.66 v42.93,30.73
ENC_I_X  (1 unrouted)
EXTAL0  (2 unrouted)
GND  (via drill 0.25)  (21 unrouted)
  Top 0.254: 26.16,7.11 25.78,6.73 U$1.11 23.5,6.73 22.86,7.37 23.62,6.6 23.37,6.6 23.11,6.35 22.1,6.35 21.84,6.35 | U$3.4 32.05,17.07 32,17.02 31.5,17.02 v31.24,17.02 | U1.7 46.66,26.49 46.23,26.92 45.95,27.2 P18.2 43.92,27.2 v43.94,27.18
  Bottom 0.254: CA1.PA2 CA1.PB2 CA1.PC2 43.98,27.22 v43.94,27.18
  other vias: 30.73,13.46
  pour Bottom (isolate 0.305, rank 6): -1.27,20.32 62.23,20.32 62.23,-1.27 -1.27,-1.27
  pour Top (rank 6): -2.54,20.83 63.5,20.83 63.5,-1.27 -2.54,-1.27
HOA
  Top 0.254: U$1.19 27.14,16.89 R3.1
HOB
  Top 0.254: R9.1 35.56,8.89 35.05,8.89 34.04,9.91 30.73,9.91 29.72,10.92 29.21,10.92 28.7,11.43 28.45,11.68 27.18,11.68 26.92,11.68 26.16,11.68 26.04,11.81 U$1.15
HOC  (1 unrouted)
  Top 0.254: R11.1 35.56,13.21 35.56,12.95 35.05,12.95 34.8,12.7 34.8,11.18 34.54,10.92 31.75,10.92 31.5,10.92 31.24,10.92 30.99,11.18 30.73,11.43 30.23,11.94 30.23,12.19 29.72,12.7 29.21,12.7 28.7,12.19 26.42,12.19 26.16,12.45 23.11,12.45 | U$1.9 16.89,8 17.02,8.13
LEDRGB-BLU/PTE25  (1 unrouted)
LEDRGB-GRN/PTD7  (1 unrouted)
LEDRGB-RED/PTD1  (1 unrouted)
LOA
  Top 0.254: U$1.17 26.96,14.35 27.43,13.97 27.09,13.97 R8.1
LOB
  Top 0.254: U$1.13 25.78,9.27 25.91,9.4 26.16,9.65 26.42,9.91 26.42,10.41 26.67,10.67 27.69,10.67 27.94,10.41 28.96,9.4 | 28.96,9.4 29.12,9.4 | 29.12,9.4 28.96,9.4 | 28.96,9.4 29.12,9.4 | 29.12,9.4 28.96,9.4 | 28.96,9.4 29.12,9.4 | 29.12,9.4 33.78,9.4 34.54,8.64 34.54,7.62 33.27,6.35 32.77,5.84 32.77,5.59 32,4.83 32,4.32 32.26,4.06 32.51,3.81 33.27,3.81 33.53,3.56 34.8,3.56 R10.1
LOC  (via drill 0.25)
  Top 0.254: v32.77,4.57 33.27,5.08 33.27,5.59 34.54,6.86 35.31,6.86 R12.1 | v26.16,6.1 24.64,6.1 24.38,5.84 21.59,5.84 21.34,6.1 19.05,8.38 19.05,8.89 17.53,10.41 17.02,10.41 16.89,10.54 U$1.7
  Bottom 0.254: v32.77,4.57 27.43,4.57 26.67,5.33 26.16,5.84 v26.16,6.1
N$1  (via drill 0.25)
  Top 0.254: U8.4 47.24,19.05 46.99,19.3 40.13,19.3 v38.86,18.03 | R3.2 27.09,18.63 26.92,18.8 26.92,18.54 26.92,18.29 26.92,19.05 v25.88,19.05
  Bottom 0.254: v38.86,18.03 37.85,19.05 v25.88,19.05
N$2  (via drill 0.25)
  Top 0.254: U9.1 50.55,18.54 51.05,18.54 v51.05,19.3 | v38.86,19.05 37.59,19.05 R13.1 | 49.78,16 49.02,16 | 49.78,18.54 49.78,19.3
  Top 0.406: U9.3 U9.1
  Bottom 0.254: v51.05,19.3 51.05,18.29 50.29,18.29 | 50.29,18.29 49.78,18.8 | 49.78,18.8 49.78,19.3 | 49.78,19.3 v49.53,19.3 | v49.53,19.3 49.02,19.3 | 49.02,19.3 49.02,18.8 | 49.02,18.8 49.78,18.8 | 49.78,18.8 49.78,18.29 | 49.78,18.29 49.02,18.29 | 49.02,18.29 49.02,16.26 49.78,16.26 49.78,18.29 | 49.78,18.29 50.29,18.29 | v49.02,16.51 49.02,18.29 | 49.02,18.29 49.02,18.8 | 49.02,18.8 49.02,19.3 | 49.02,19.3 48.77,19.3 49.02,19.3 | 49.02,19.3 v49.53,19.3 | v49.53,19.3 49.78,19.3 | 49.78,19.3 v51.05,19.3 | v51.05,19.3 v50.29,19.3 | v50.29,19.3 50.29,18.8 49.78,18.8 | 49.78,18.8 49.78,19.3 | 49.78,19.3 v49.53,19.3 | v50.29,19.3 v51.05,19.3 | 49.02,18.8 49.02,19.3 | 49.02,19.3 39.88,19.3 39.62,19.05 39.37,19.05 v38.86,19.05
  Bottom 0.406: R1.2 50.55,17.53 50.29,17.78
  pour Top (isolate 0.305): 48.77,19.56 52.07,19.56 52.07,15.49 48.77,15.49
  pour Bottom (isolate 0.305, rank 5): 51.82,19.81 48.77,19.81 48.77,15.75 51.82,15.75
N$3  (via drill 0.25)
  Top 0.254: U9.4 50.04,14.73 49.53,14.99 49.28,14.99 v49.02,15.24 | v38.86,14.48 38.61,14.22 29.46,14.22 29.21,13.97 R8.2
  Bottom 0.254: v49.02,15.24 48.77,15.24 48.01,15.24 46.99,15.24 46.23,14.48 41.4,14.48 40.64,15.24 39.88,15.24 39.62,15.24 v38.86,14.48
N$4  (via drill 0.25)
  Top 0.254: U10.4 47.12,5.71 46.99,5.84 v46.99,7.11 | v38.86,9.14 37.43,9.14 R9.2
  Bottom 0.254: v46.99,7.11 40.64,7.11 39.62,7.11 38.86,7.87 v38.86,9.14
N$5  (1 unrouted)
N$6  (1 unrouted)
N$7  (1 unrouted)
N$9  (via drill 0.25)
  Top 0.254: U11.4 49.91,1.91 49.28,2.54 v49.02,2.54 | R10.2 v38.86,3.56
  Bottom 0.254: v49.02,2.54 46.99,2.54 46.23,1.78 40.64,1.78 40.13,2.29 | 40.13,2.29 39.88,2.54 | v38.86,3.56 40.13,2.29
N$10  (via drill 0.25)
  Top 0.254: U12.4 47.5,12.19 47.24,12.19 46.99,12.19 v46.99,13.46 | v39.12,13.46 37.85,13.46 37.68,13.46 R11.2
  Bottom 0.254: v46.99,13.46 45.72,13.46 42.16,13.46 41.91,13.46 41.15,13.46 40.64,13.46 40.39,13.46 v39.12,13.46
N$11  (via drill 0.25)
  Top 0.254: v39.88,6.35 39.12,5.59 38.86,5.33 37.68,5.33 R17.1 | U11.3 50.4,3.81 | 50.4,4.57 U11.2 50.4,3.81 | 50.4,4.57 49.02,4.57 | 49.02,4.57 49.02,5.84 | 49.02,5.84 50.29,5.84 v50.29,6.6 49.02,6.6 | 49.02,6.6 49.02,5.84 | 49.02,5.84 50.04,5.84 49.78,5.84 49.53,5.84 v49.53,6.6 | v49.53,6.6 49.02,6.6 | 49.02,6.6 v49.53,6.6 | 50.4,4.57 50.4,3.81 | v49.02,3.81 49.02,4.57 | U11.1 50.4,5.84 51.05,5.84 v51.05,6.6 v49.53,6.6
  Bottom 0.254: v49.53,6.6 47.5,6.6 47.24,6.35 46.74,6.35 46.48,6.6 40.89,6.6 40.13,6.6 v39.88,6.35 | R2.2 50.55,5.71 U11.1 50.4,6.6 | 50.4,6.6 v50.29,6.6 50.29,4.45 U11.2 50.4,6.6 | 50.4,6.6 v51.05,6.6 51.05,4.45 | 49.02,6.1 51.18,6.1 | v49.02,3.81 51.18,3.81 | 49.02,5.84 51.18,5.84
  pour Top (isolate 0.305, rank 2): 51.82,6.86 51.82,2.79 48.77,2.79 48.77,6.86
  pour Bottom (isolate 0.305, rank 5): 48.77,7.11 48.77,2.79 51.56,2.79 51.56,7.11
N$12  (via drill 0.25)
  Top 0.254: U13.1 50.04,12.19 | R6.1 37.43,11.94 38.1,11.94 v38.86,11.94 | U13.3 50.4,10.16 | U13.2 50.4,10.92 49.02,10.92 | 49.02,10.92 v49.02,10.16 | U13.1 arc-90 50.27,11.94 49.53,11.94 | 49.53,11.94 49.02,11.94 | 49.02,11.94 49.02,10.92 | 49.02,10.92 49.02,11.94 | 49.02,11.94 49.02,12.95 v49.53,12.95 | v49.53,12.95 v50.29,12.95 | v50.29,12.95 v51.05,12.95 51.05,11.94 50.29,11.94 v50.29,12.95 | v50.29,12.95 v49.53,12.95 | v49.53,12.95 49.53,11.94 | 49.53,11.94 50.4,11.94 U13.1
  Bottom 0.254: v51.05,12.95 v50.29,12.95 | v50.29,12.95 v49.53,12.95 | v49.53,12.95 49.02,12.95 | 49.02,12.95 48.01,12.95 47.5,12.95 47.24,12.7 46.99,12.7 46.74,12.7 46.48,12.95 42.93,12.95 42.42,12.95 42.16,12.95 40.64,12.95 39.88,12.95 v38.86,11.94 | v49.02,10.16 49.02,12.95 | 49.02,12.95 v49.02,10.16 | v49.02,10.16 50.29,10.16 v50.29,12.95 | v49.53,12.95 49.53,12.45 49.53,12.06 U13.1 50.55,12.06 R4.2 | v50.29,12.95 v51.05,12.95 | v51.05,12.95 51.05,12.19
  pour Bottom (isolate 0.305, rank 5): 51.56,13.21 51.56,9.4 48.77,9.4 48.77,13.21
  pour Top (isolate 0.305): 48.77,13.21 48.77,9.14 51.82,9.14 51.82,13.21
N$13
  Top 0.254: U$3.6 32.69,11.94 33.02,11.94 33.35,11.94 U$3.7
N$14  (3 unrouted)
N$15  (via drill 0.25)  (1 unrouted)
  Top 0.254: U$1.20 22.73,18.16 v22.61,18.29
  Bottom 0.254: v22.61,18.29 D3.C
N$16  (via drill 0.25)  (1 unrouted)
  Top 0.254: U$1.16 22.48,13.08 v22.35,13.21
  Bottom 0.254: v22.35,13.21 D2.C
N$17  (via drill 0.25)
  Top 0.254: U13.4 49.91,8.26 49.28,8.89 v49.02,8.89 | v39.88,8.89 38.61,7.62 38.1,7.62 37.85,7.62 37.59,7.37 R12.2
  Bottom 0.254: v49.02,8.89 46.99,8.89 46.23,8.13 41.4,8.13 40.64,8.89 v39.88,8.89
N$18  (2 unrouted)
N$19
  Top 0.254: U1.2 U1.13
N$20  (2 unrouted)
N$21  (2 unrouted)
N$22  (2 unrouted)
N$23
  Top 0.254: U1.4 U1.11
N$24
  Top 0.254: U1.6 U1.9
N$25  (1 unrouted)
N$28  (1 unrouted)
N$29  (1 unrouted)
N$30  (1 unrouted)
N$31  (2 unrouted)
N$32  (2 unrouted)
PH_A  (via drill 0.25)  (1 unrouted)
  Top 0.254: U8.1 47.5,14.48 47.75,14.48 47.75,14.22 47.75,13.97 v48.01,13.72 48.51,13.72 | U$1.18 25.78,15.62 26.16,15.24 29.72,15.24 30.23,14.73 35.05,14.73 38.1,14.73 38.61,15.24 39.37,15.24 39.88,14.73 v39.88,14.48
  Top 0.406: 55.63,18.03 57.91,18.03 P1.P$1 57.91,14.99 55.63,14.99 55.63,18.03 | 52.83,18.03 55.63,18.03
  Bottom 0.254: v48.01,13.72 47.5,14.22 46.74,14.22 46.48,13.97 41.15,13.97 40.64,14.48 v39.88,14.48
  other vias: 52.58,19.3 54.36,19.3 56.39,19.3 58.42,19.3 52.58,13.72 54.36,13.72 56.39,13.72 58.42,13.72 52.58,18.29 56.39,18.29 56.39,14.73 52.58,14.73 54.36,16.51 54.36,18.29 56.39,16.51 52.58,16.51 54.36,14.73
  pour Top (isolate 0.254, rank 3): 59.69,20.32 45.97,20.32 45.97,12.95 59.69,12.95
  pour Bottom (isolate 0.305): 58.93,19.81 58.93,13.21 51.56,13.21 51.56,19.81
PH_B  (via drill 0.25)  (1 unrouted)
  Top 0.254: U10.1 47.39,1.78 48.77,1.78 | 48.77,1.78 v48.77,1.27 | v48.77,1.27 47.5,1.27 | 47.5,1.27 47.5,1.52 47.5,1.78 48.77,1.78 | 48.77,1.78 v48.77,1.27 | U10.3 47.39,1.02 47.5,1.12 47.5,1.27 | 47.5,1.27 47.5,1.02 49.02,1.02 v48.77,1.27 | 53.34,5.59 U11.5 | v39.12,1.78 38.86,1.52 37.59,1.52 31.75,1.52 31.5,1.52 31.24,1.27 23.88,1.27 22.86,2.29 v21.84,2.29 | v22.1,7.37 22.1,10.16 22.61,10.67 24.38,10.67 U$1.14
  Top 0.406: P2.P$1 57.91,5.59 53.34,5.59 53.09,5.59 | P2.P$1 57.91,2.03 v54.36,2.03 54.36,1.27 v54.36,1.02 58.42,1.02 49.02,1.02 v48.77,1.27 | P2.P$1 54.61,4.06 U11.5
  Bottom 0.254: v48.77,1.27 47.24,1.27 46.48,1.27 40.39,1.27 39.62,1.27 v39.12,1.78 | v21.84,2.29 21.34,2.79 21.34,4.57 21.59,4.83 21.84,5.08 22.1,5.33 22.1,6.35 v22.1,7.37
  other vias: 52.58,5.59 52.58,3.81 52.58,2.03 54.36,5.59 54.36,3.81 56.39,2.03 56.39,3.81 56.39,5.59 57.91,6.35 57.91,1.27 56.39,1.02 52.58,1.02
  pour Top (isolate 0.305, rank 3): 59.69,6.6 45.97,6.6 45.97,0 59.69,0
  pour Bottom (isolate 0.305, rank 4): 58.67,6.86 58.67,0.76 51.31,0.76 51.31,6.86
PH_C  (via drill 0.25)  (1 unrouted)
  Top 0.254: U12.1 48.64,8.26 48.77,8.13 48.77,7.62 48.51,7.37 v48.01,7.37 | v39.88,7.87 38.1,6.1 34.54,6.1 33.78,5.33 v33.78,4.32 | v25.15,5.33 21.34,5.33 20.83,5.84 18.03,8.64 18.03,8.89 17.53,9.4 17.27,9.4 15.24,9.4 U$1.8
  Top 0.406: P3.P$1 57.91,11.94 56.13,11.94 56.13,8.38 52.83,8.38 57.91,8.38
  Bottom 0.254: v48.01,7.37 47.5,7.87 46.74,7.87 46.48,7.62 41.15,7.62 40.89,7.87 v39.88,7.87 | v33.78,4.32 33.27,3.81 32.26,3.81 32,4.06 27.69,4.06 26.92,4.06 25.65,5.33 v25.15,5.33
  other vias: 52.58,11.94 54.36,11.94 56.39,11.94 57.91,12.7 57.91,7.62 56.39,8.38 54.36,8.38 52.58,8.38 52.58,10.16 54.36,10.16 56.39,10.16 52.58,7.37 54.36,7.37 56.39,7.37
  pour Top (isolate 0.305, rank 2): 59.69,12.7 46.23,12.7 46.23,7.37 59.69,7.37
  pour Bottom (isolate 0.305, rank 3): 58.67,13.21 58.67,7.11 51.31,7.11 51.31,13.21
PWM_AB  (1 unrouted)
PWM_AT  (1 unrouted)
PWM_BB  (1 unrouted)
PWM_BT  (1 unrouted)
PWM_CB  (1 unrouted)
PWM_CT  (1 unrouted)
RESET_B  (1 unrouted)
STB  (1 unrouted)
SWD_CLK  (1 unrouted)
SWD_DIO  (2 unrouted)
TRACE_SWO  (1 unrouted)
VOLT_DCB/ADC0_SE13  (3 unrouted)
XTAL0  (2 unrouted)

### Text on the board
Document: Optional / Encoder input / for Robotics | KV11 | Electrolytic / Capacitor | Alternate / connector / types | Electrolytic / Capacitor | Adjust board size / for soldering / wires and CAP